# EAGLE design Keyglove Kit v0.2 (EAGLE 6.1)
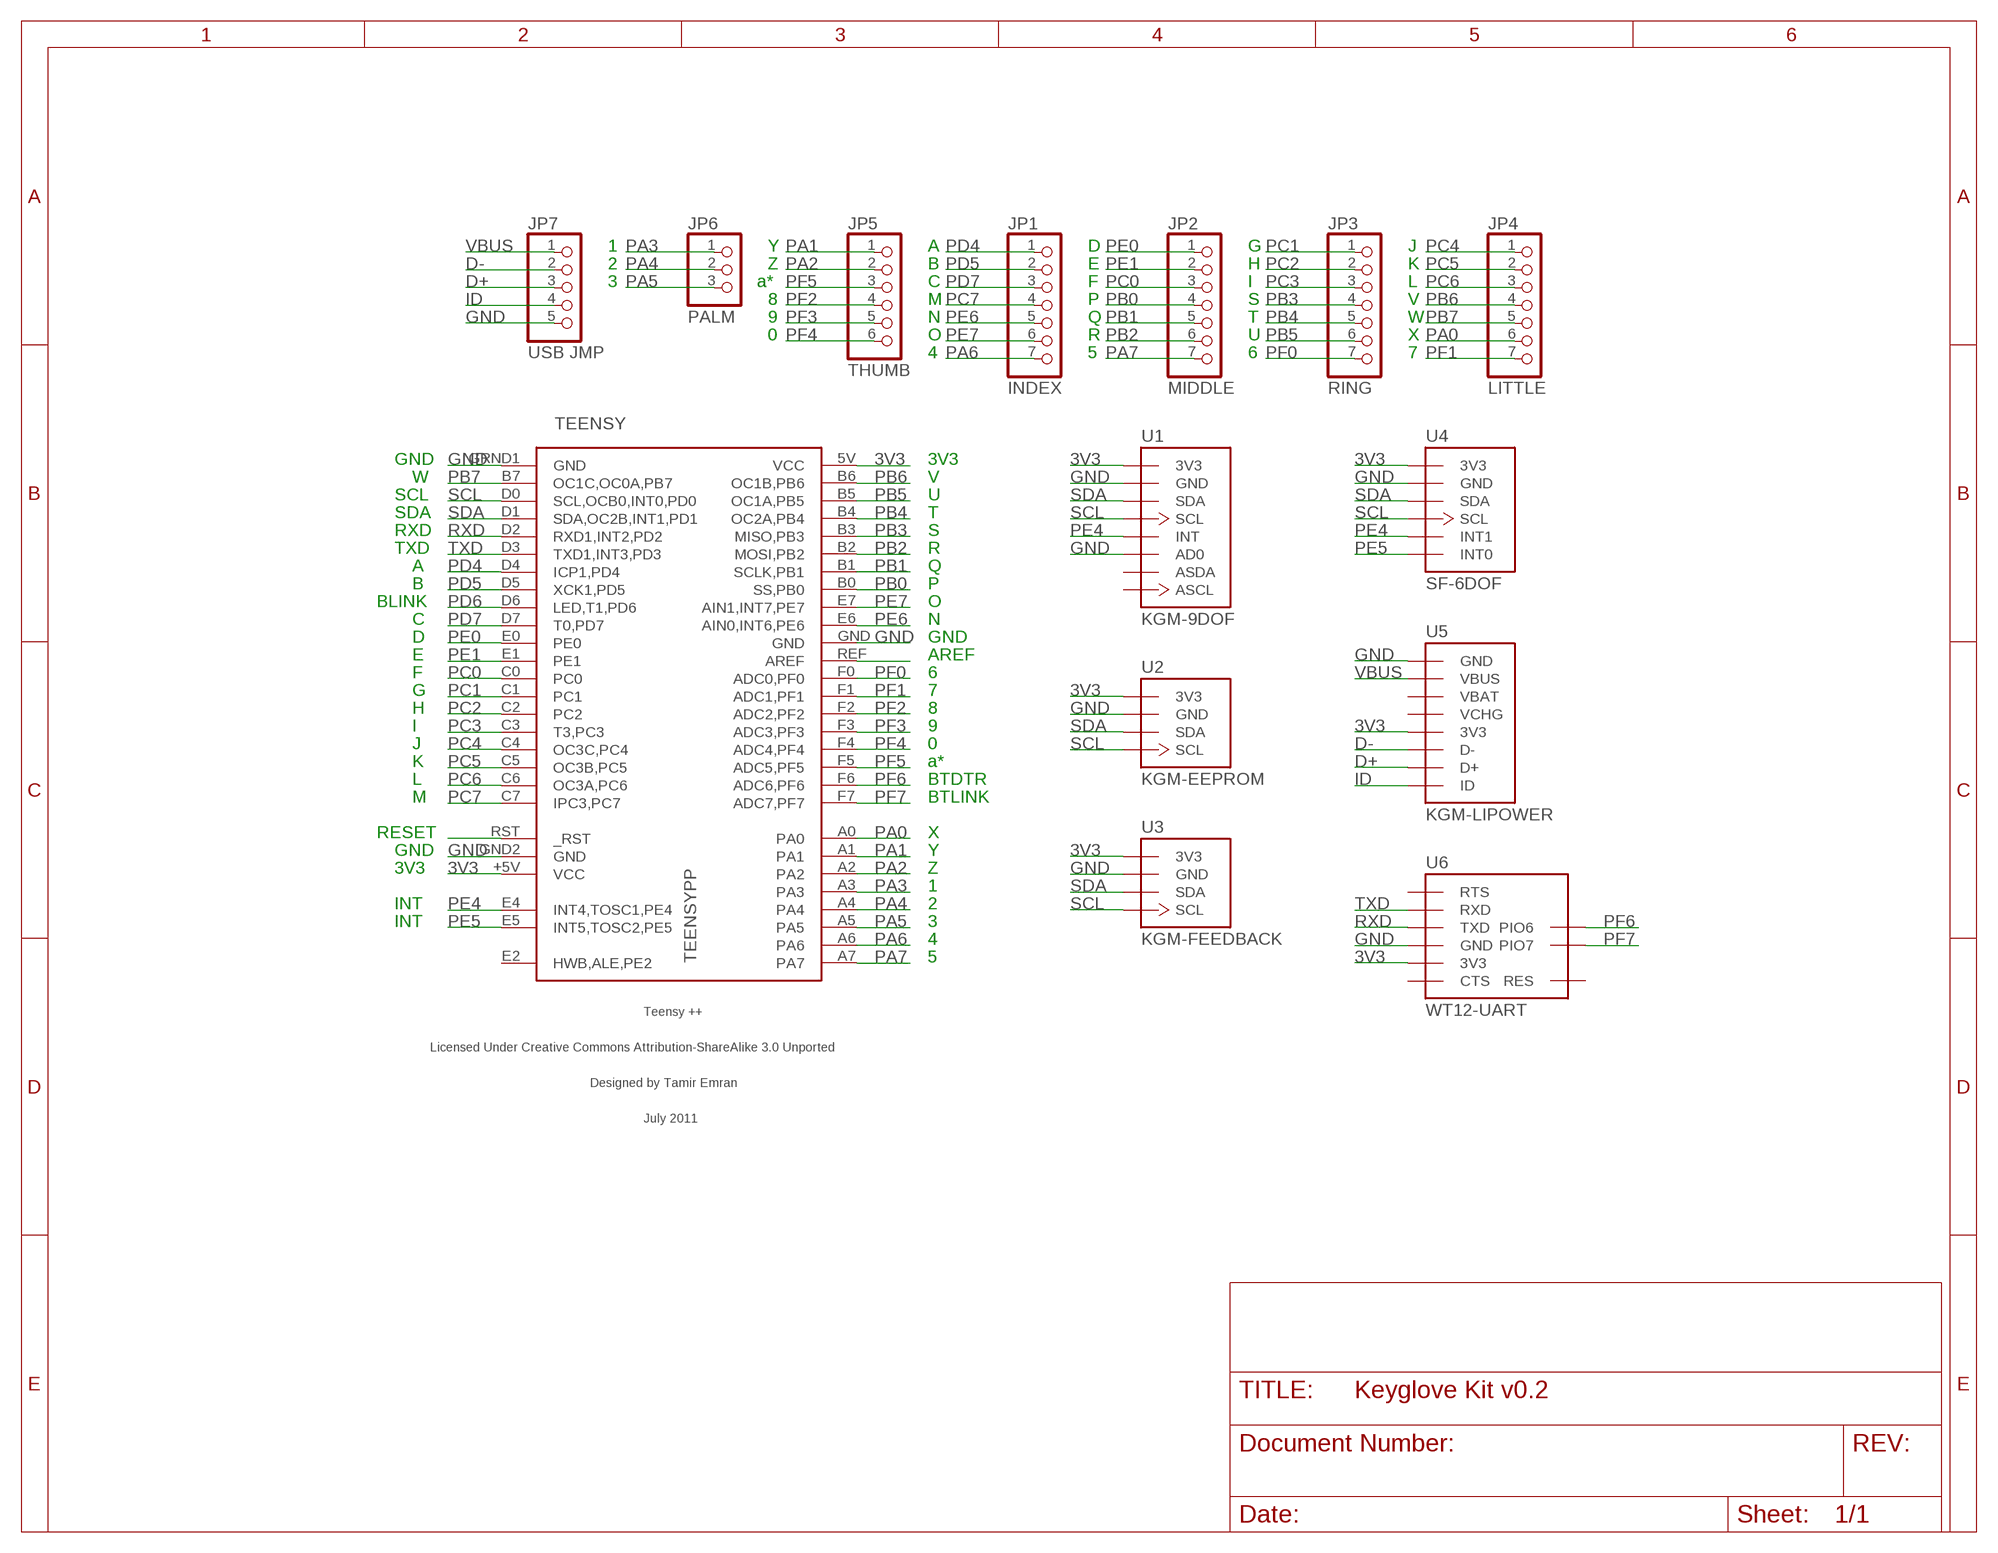
[diagram p0: schematic, sheet 1]

## Parts
JP1  INDEX  PINHD-1X7  [1X07]
JP2  MIDDLE  PINHD-1X7  [1X07]
JP3  RING  PINHD-1X7  [1X07]
JP4  LITTLE  PINHD-1X7  [1X07]
JP5  THUMB  PINHD-1X6  [1X06]
JP6  PALM  PINHD-1X3  [1X03]
JP7  USB JMP  PINHD-1X5  [1X05]
TEENSY  TEENSYPP  [TEENSYPP]
U1  KGM-9DOF  [KGM-9DOF]
U2  KGM-EEPROM  [KGM-EEPROM]
U3  KGM-FEEDBACK  [KGM-FEEDBACK]
U4  SF-6DOF  [SF-6DOF]
U5  KGM-LIPOWER  [KGM-LIPOWER]
U6  WT12-UART  [WT12-UART]

## Nets
3V3 [power]: TEENSY.5V(VCC) TEENSY.+5V(VCC) U1.3V3 U2.3V3 U3.3V3 U4.3V3 U5.3V3 U6.3V3
D+: JP7.3 U5.D+
D-: JP7.2 U5.D-
GND [power]: JP7.5 TEENSY.GND TEENSY.GND2(GND) TEENSY.GRND1(GND) U1.AD0 U1.GND U2.GND U3.GND U4.GND U5.GND U6.GND
ID: JP7.4 U5.ID
N$107: TEENSY.RST(_RST)
N$128: TEENSY.REF(AREF)
PA0: JP4.6 TEENSY.A0
PA1: JP5.1 TEENSY.A1
PA2: JP5.2 TEENSY.A2
PA3: JP6.1 TEENSY.A3
PA4: JP6.2 TEENSY.A4
PA5: JP6.3 TEENSY.A5
PA6: JP1.7 TEENSY.A6
PA7: JP2.7 TEENSY.A7
PB0: JP2.4 TEENSY.B0(SS,PB0)
PB1: JP2.5 TEENSY.B1(SCLK,PB1)
PB2: JP2.6 TEENSY.B2(MOSI,PB2)
PB3: JP3.4 TEENSY.B3(MISO,PB3)
PB4: JP3.5 TEENSY.B4(OC2A,PB4)
PB5: JP3.6 TEENSY.B5(OC1A,PB5)
PB6: JP4.4 TEENSY.B6(OC1B,PB6)
PB7: JP4.5 TEENSY.B7(OC1C,OC0A,PB7)
PC0: JP2.3 TEENSY.C0
PC1: JP3.1 TEENSY.C1
PC2: JP3.2 TEENSY.C2
PC3: JP3.3 TEENSY.C3(T3,PC3)
PC4: JP4.1 TEENSY.C4(OC3C,PC4)
PC5: JP4.2 TEENSY.C5(OC3B,PC5)
PC6: JP4.3 TEENSY.C6(OC3A,PC6)
PC7: JP1.4 TEENSY.C7(IPC3,PC7)
PD4: JP1.1 TEENSY.D4(ICP1,PD4)
PD5: JP1.2 TEENSY.D5(XCK1,PD5)
PD6: TEENSY.D6(LED,T1,PD6)
PD7: JP1.3 TEENSY.D7(T0,PD7)
PE0: JP2.1 TEENSY.E0
PE1: JP2.2 TEENSY.E1
PE4: TEENSY.E4(INT4,TOSC1,PE4) U1.INT U4.INT1
PE5: TEENSY.E5(INT5,TOSC2,PE5) U4.INT0
PE6: JP1.5 TEENSY.E6(AIN0,INT6,PE6)
PE7: JP1.6 TEENSY.E7(AIN1,INT7,PE7)
PF0: JP3.7 TEENSY.F0(ADC0,PF0)
PF1: JP4.7 TEENSY.F1(ADC1,PF1)
PF2: JP5.4 TEENSY.F2(ADC2,PF2)
PF3: JP5.5 TEENSY.F3(ADC3,PF3)
PF4: JP5.6 TEENSY.F4(ADC4,PF4)
PF5: JP5.3 TEENSY.F5(ADC5,PF5)
PF6: TEENSY.F6(ADC6,PF6) U6.PIO6
PF7: TEENSY.F7(ADC7,PF7) U6.PIO7
RXD: TEENSY.D2(RXD1,INT2,PD2) U6.TXD
SCL: TEENSY.D0(SCL,OCB0,INT0,PD0) U1.SCL U2.SCL U3.SCL U4.SCL
SDA: TEENSY.D1(SDA,OC2B,INT1,PD1) U1.SDA U2.SDA U3.SDA U4.SDA
TXD: TEENSY.D3(TXD1,INT3,PD3) U6.RXD
VBUS [power]: JP7.1 U5.VBUS
Unconnected: TEENSY.E2(HWB,ALE,PE2) U1.ASCL U1.ASDA U6.CTS U6.RESET(RES) U6.RTS

## Notes on the sheet
- 1 | Y | A | D | G | J
- 2 | Z | B | E | H | K
- 3 | a* | C | F | I | L
- 8 | M | P | S | V
- 9 | N | Q | T | W
- 0 | O | R | U | X
- 4 | 5 | 6 | 7
- GND | 3V3
- W | V
- SCL | U
- SDA | T
- RXD | S
- TXD | R
- A | Q
- B | P
- BLINK | O
- C | N
- D | GND
- E | AREF
- F | 6
- G | 7
- H | 8
- I | 9
- J | 0
- K | a*
- L | BTDTR
- M | BTLINK
- RESET | X
- GND | Y
- 3V3 | Z
- 1
- INT | 2
- INT | 3
- 4
- 5

## Power pins joined to a net without a drawn wire
VBAT: U5.VBAT
VCHG: U5.VCHG

## Library data of the parts
JP1-JP4 = sf-pinhead:PINHD-1X7: PIN HEADER
JP5 = sf-pinhead:PINHD-1X6: PIN HEADER
JP6 = sf-pinhead:PINHD-1X3: PIN HEADER
JP7 = sf-pinhead:PINHD-1X5: PIN HEADER
TEENSY = sf-keyglovekit:TEENSYPP: Teensy++ Teensy++ board by PJRC <http://www.pjrc.com/>. Eagle part designed by Tamir Emran, July 2011. Licensed under Create Commons Attribution-ShareAlike 3.0 Unported license (CC-BY-SA-3.0).
U1 = sf-keyglovekit:KGM-9DOF
U2 = sf-keyglovekit:KGM-EEPROM
U3 = sf-keyglovekit:KGM-FEEDBACK
U4 = sf-keyglovekit:SF-6DOF
U5 = sf-keyglovekit:KGM-LIPOWER
U6 = sf-keyglovekit:WT12-UART

## Net classes
0 default: width 0.152 mm, drill 0.33 mm, clearance 0.152 mm
1 power: width 0.203 mm, drill 0.33 mm, clearance 0.152 mm

## Board
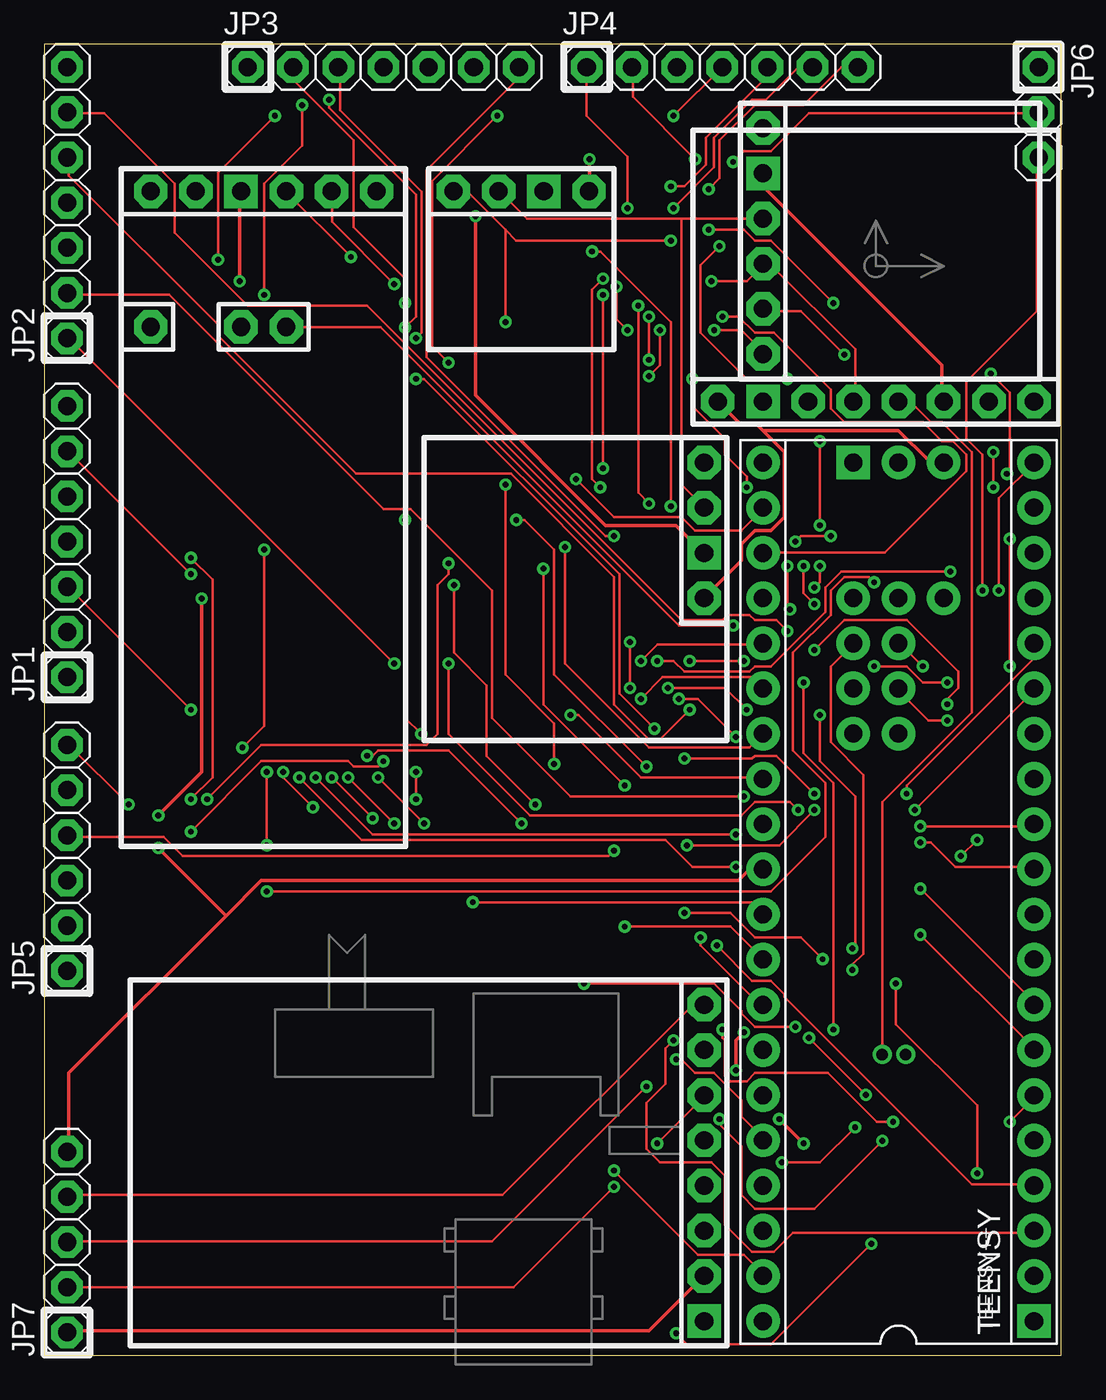
[diagram p1: board, top side]
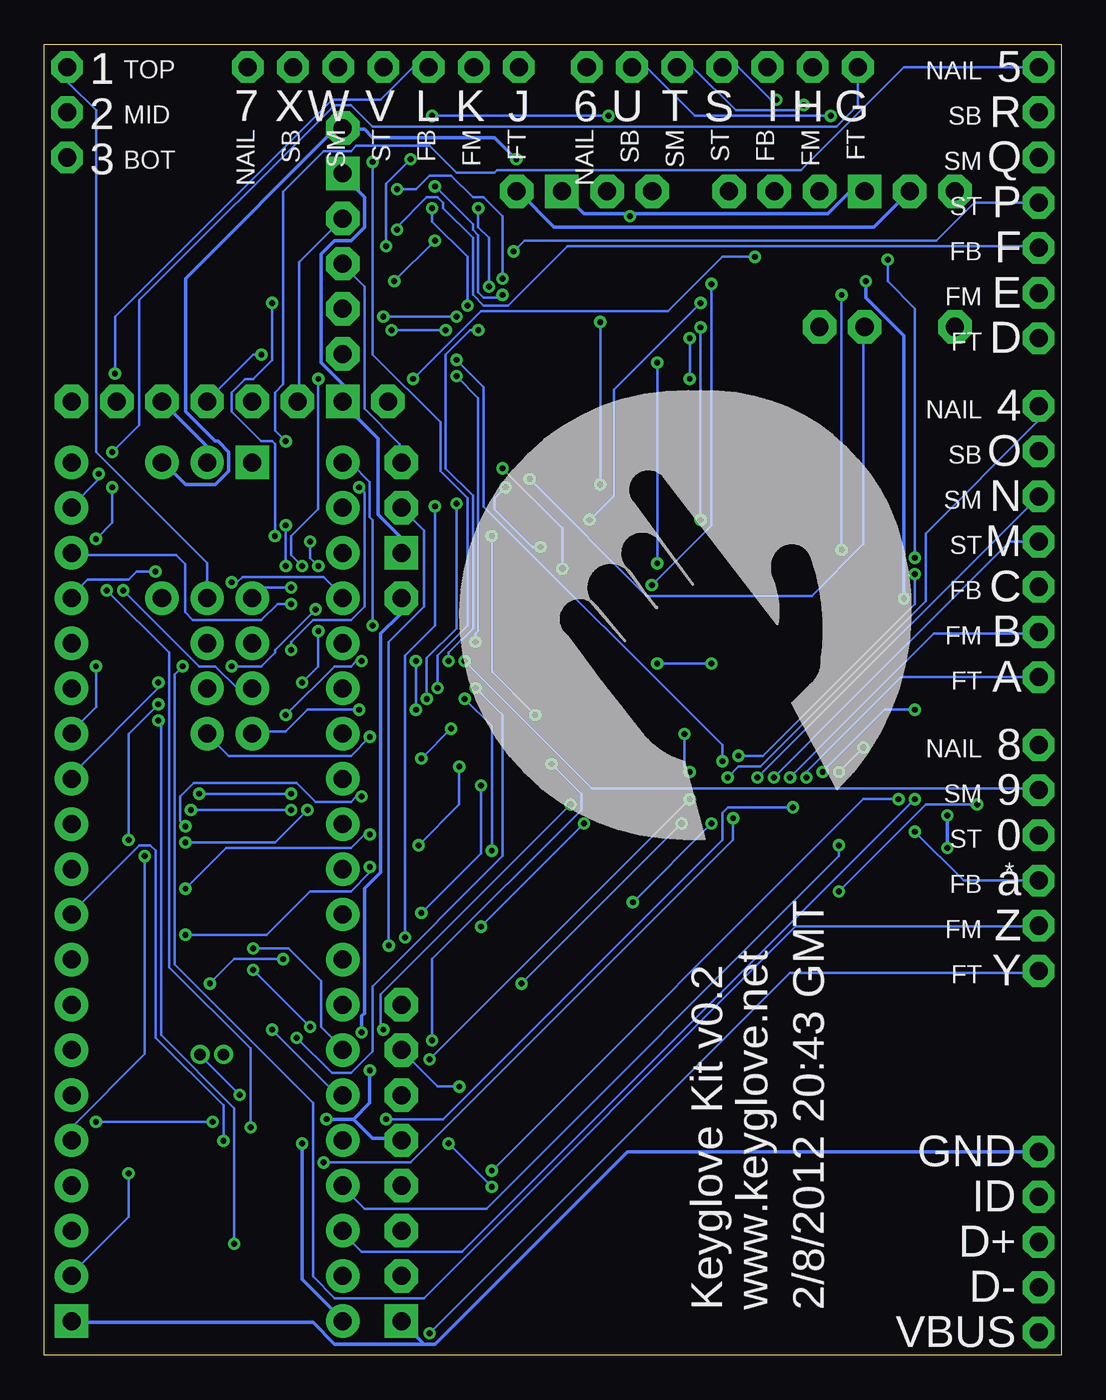
[diagram p2: board, bottom side, seen from below]

Size 57.15 x 73.66 mm. Coordinates in mm from the lower left corner, seen from the top.
Outline: 0,0 57.15,0 57.15,73.66 0,73.66 0,0
Copper layers (1*16): Top 0.0356mm / dielectric 1.5011mm / Bottom 0.0356mm
Design rules: minimum track width 6mil, minimum drill 13mil, track to track 6mil, track to pad 6mil, pad to pad 6mil, via to via 6mil, smd to smd 6mil, copper to edge 15mil, drill to drill 6mil, minimum pad ring 7mil, minimum via ring 7mil, stop-mask expansion 4mil, vias tented up to drill 20mil, thermal gap 10mil

### Footprints (pad centres in the part's own frame; a part is rotated, then mirrored left to right if it is on the bottom)
1X07 = drill 1.016 pad 1.778 octagon: 1 -7.62,0; 2 -5.08,0; 3 -2.54,0; 4 0,0; 5 2.54,0; 6 5.08,0; 7 7.62,0
1X06 = drill 1.016 pad 1.778 octagon: 1 -6.35,0; 2 -3.81,0; 3 -1.27,0; 4 1.27,0; 5 3.81,0; 6 6.35,0
1X03 = drill 1.016 pad 1.778 octagon: 1 -2.54,0; 2 0,0; 3 2.54,0
1X05 = drill 1.016 pad 1.778 octagon: 1 -5.08,0; 2 -2.54,0; 3 0,0; 4 2.54,0; 5 5.08,0
TEENSYPP = drill 1.016 pad 1.88: 5V 24.13,-2.54; +5V -24.13,7.62; A0 8.89,0; A1 11.43,0; A2 13.97,0; A3 16.51,0; A4 8.89,2.54; A5 11.43,2.54; A6 13.97,2.54; A7 16.51,2.54; B0 -6.35,7.62; B1 -8.89,7.62; B2 -11.43,7.62; B3 -13.97,7.62; B4 -16.51,7.62; B5 -19.05,7.62; B6 -21.59,7.62; B7 -21.59,-7.62; C0 6.35,-7.62; C1 8.89,-7.62; C2 11.43,-7.62; C3 13.97,-7.62; C4 16.51,-7.62; C5 19.05,-7.62; C6 21.59,-7.62; C7 24.13,-7.62; D0 -19.05,-7.62; D1 -16.51,-7.62; D2 -13.97,-7.62; D3 -11.43,-7.62; D4 -8.89,-7.62; D5 -6.35,-7.62; D6 -3.81,-7.62; D7 -1.27,-7.62; E0 1.27,-7.62; E1 3.81,-7.62; E2 16.51,-2.54; E6 -1.27,7.62; E7 -3.81,7.62; F0 6.35,7.62; F1 8.89,7.62; F2 11.43,7.62; F3 13.97,7.62; F4 16.51,7.62; F5 19.05,7.62; F6 21.59,7.62; F7 24.13,7.62; GND2 24.13,0; GRND1 1.27,7.62; REF 3.81,7.62 | drill 0.635 pad 1.067: E4 -9.144,0.914; E5 -9.144,-0.406 | drill 1.016 pad 1.88 square: GND -24.13,-7.62; RST 24.13,2.54
KGM-9DOF = drill 1.016 pad 1.88 octagon: 3V3 1.27,19.177; AD0 1.27,6.477; ASCL 1.27,1.397; ASDA 1.27,3.937; INT 1.27,9.017; SCL 1.27,11.557; SDA 1.27,14.097 | drill 1.016 pad 1.88 square: GND 1.27,16.637
KGM-EEPROM = drill 1.016 pad 1.88 octagon: 3V3 1.27,9.017; SCL 1.27,1.397; SDA 1.27,3.937 | drill 1.016 pad 1.88 square: GND 1.27,6.477
KGM-FEEDBACK = drill 1.016 pad 1.88 octagon: 3V3 1.27,9.017; SCL 1.27,1.397; SDA 1.27,3.937 | drill 1.016 pad 1.88 square: GND 1.27,6.477
SF-6DOF = drill 1.016 pad 1.88 octagon: 3V3 1.27,14.097; INT0 1.27,1.397; INT1 1.27,3.937; SCL 1.27,6.477; SDA 1.27,9.017 | drill 1.016 pad 1.88 square: GND 1.27,11.557
KGM-LIPOWER = drill 1.016 pad 1.88 octagon: 3V3 1.27,9.017; D+ 1.27,3.937; D- 1.27,6.477; ID 1.27,1.397; VBAT 1.27,14.097; VBUS 1.27,16.637; VCHG 1.27,11.557 | drill 1.016 pad 1.88 square: GND 1.27,19.177
WT12-UART = drill 1.016 pad 1.88 octagon: 3V3 1.27,4.191; CTS 1.27,1.651; PIO6 8.89,6.731; PIO7 8.89,9.271; RESET 8.89,1.651; RTS 1.27,14.351; RXD 1.27,11.811; TXD 1.27,9.271 | drill 1.016 pad 1.88 square: GND 1.27,6.731

### Placement (x,y rotation side)
JP1  1.27,45.72 90 top
JP2  1.27,64.77 90 top
JP3  19.05,72.39 0 top
JP4  38.1,72.39 0 top
JP5  1.27,27.94 90 top
JP6  55.88,69.85 270 top
JP7  1.27,6.35 90 top
TEENSY  48.01,26.04 90 top
U1  57.02,52.32 90 top
U2  21.59,66.67 270 top
U3  38.35,51.56 180 top
U4  39.12,54.86 0 top
U5  38.35,21.08 180 top
U6  4.32,66.67 270 top

### Tracks (layer width: path | path; a pad name or v marks a point on that pad's centre or on a via)
3V3  (via drill 0.33)
  Top 0.203: v30.63,67.21 30.63,65.53 U2.3V3 | v42.67,11.89 v41.3,13.26 | 37.19,42.52 U3.3V3 37.19,42.67 39.17,44.65 39.17,45.57 39.93,46.33 40.84,46.33 41.6,47.09 41.6,50.75 40.39,51.97 | 40.39,51.97 40.08,52.27 39.17,52.27 U1.3V3 | 40.39,51.97 48.01,51.97 49.68,50.29 50.44,50.29 TEENSY.5V | v38.86,16 38.86,17.68 v39.32,18.14
  Bottom 0.203: U6.3V3 10.52,63.4 28.5,63.4 30.48,65.38 U2.3V3 | 40.39,68.89 39.17,68.89 38.71,68.43 31.85,68.43 v30.63,67.21 | 39.78,13.26 38.71,12.19 37.19,12.19 U5.3V3 | v41.3,13.26 39.78,13.26 | v42.67,11.89 42.67,4.27 40.39,1.98 TEENSY.+5V | 39.78,13.26 38.86,14.17 v38.86,16 | v39.32,18.14 39.32,19.05 39.17,19.2 39.17,26.21 38.25,27.13 38.25,40.54 37.19,41.6 37.19,42.52 U3.3V3 | 40.39,68.89 40.84,68.89 49.23,60.5 49.23,53.03 47.55,51.36 47.4,51.36 46.79,50.75 46.79,49.68 47.55,48.92 49.23,48.92 50.44,50.14 TEENSY.5V | 40.39,68.89 U4.3V3
D+  (via drill 0.33)
  Top 0.152: v33.83,15.09 25.15,6.4 1.37,6.4 JP7.3
  Bottom 0.152: v33.83,15.09 35.05,15.09 37.03,17.07 U5.D+
D-  (via drill 0.33)
  Top 0.152: JP7.2 26.36,3.81 v32,9.45 | v34.44,11.89 37.03,14.48 U5.D-
  Bottom 0.152: v34.44,11.89 v32,9.45
GND  (via drill 0.33)
  Top 0.203: 37.19,45.11 U3.GND 37.03,45.11 35.51,46.63 31.55,46.63 24.23,53.95 v24.23,64.01 | 48.01,50.14 TEENSY.GND2 | U4.GND 40.39,65.68 50.44,55.63 50.44,53.65 U1.AD0 | 55.63,1.98 TEENSY.GND | 10.21,24.69 1.37,15.85 1.37,11.43 JP7.5 | 10.21,24.69 12.19,26.67 39.01,26.67 39.62,27.28 40.39,27.28 TEENSY.GRND1 | v10.97,60.35 10.97,65.38 U6.GND | v8.84,42.52 8.84,32.77 v6.4,30.33 | 10.21,24.69 v6.4,28.5
  Bottom 0.203: 24.23,64.16 26.82,64.16 U2.GND | 24.23,64.16 13.11,64.16 11.89,65.38 11.12,65.38 U6.GND | U3.GND 37.19,45.11 37.19,46.02 38.41,47.24 38.41,51.51 40.39,53.49 U1.GND 40.39,54.56 41.6,55.78 41.6,61.87 40.84,62.64 39.93,62.64 39.17,63.4 39.17,65.08 40.39,66.29 U4.GND | TEENSY.GND2 48.01,51.05 U1.AD0 | v24.23,64.01 24.23,64.16 | JP7.5 24.38,11.43 35.2,0.61 35.81,0.61 | 35.81,0.61 37.03,1.83 U5.GND | 35.81,0.61 40.84,0.61 42.06,1.83 55.63,1.83 TEENSY.GND | v10.97,60.35 10.97,59.44 8.84,57.3 v8.84,42.52 | v6.4,28.5 v6.4,30.33
ID
  Top 0.152: JP7.4 1.37,8.99 25.76,8.99 36.42,19.66 37.03,19.66 U5.ID
PA0  (via drill 0.33)
  Top 0.152: JP4.6 42.37,72.39 40.54,70.56 39.78,70.56 37.64,68.43 37.64,66.75 v35.36,64.47 | v33.38,58.98 33.38,48.46 v33.98,47.85 | v35.66,36.88 36.73,36.88 v38.86,34.75
  Bottom 0.152: v35.36,64.47 35.36,63.7 33.38,61.72 v33.38,58.98 | v33.98,47.85 33.98,40.84 35.66,39.17 v35.66,36.88 | v38.86,34.75 39.93,33.68 46.79,33.68 48.01,34.9 TEENSY.A0
PA1  (via drill 0.33)
  Top 0.152: v35.51,1.22 36.12,0.61 40.84,0.61 v46.48,6.25 | v50.75,35.66 49.68,35.66 48.01,37.34 TEENSY.A1
  Bottom 0.152: v35.51,1.22 15.24,21.49 1.37,21.49 JP5.1 | v46.48,6.25 46.48,13.87 50.6,17.98 50.6,35.51 v50.75,35.66
PA2  (via drill 0.33)
  Top 0.152: v49.38,38.71 48.01,40.08 TEENSY.A2
  Bottom 0.152: v49.38,38.71 49.84,38.25 49.84,21.95 42.06,14.17 42.06,4.42 40.84,3.2 35.81,3.2 14.94,24.08 1.37,24.08 JP5.2
PA3
  Bottom 0.152: TEENSY.A3 48.01,44.5 54.25,50.75 54.25,69.95 55.78,71.48 55.78,72.39 JP6.1
PA4  (via drill 0.33)
  Top 0.152: v38.71,67.06 39.32,67.67 40.84,67.67 42.98,69.8 55.78,69.8 JP6.2 | v35.05,37.49 38.25,37.49 v39.47,36.27
  Bottom 0.152: v38.71,67.06 38.71,56.24 34.9,52.43 34.9,49.68 33.38,48.16 33.38,41 35.05,39.32 v35.05,37.49 | v39.47,36.27 42.37,36.27 43.59,35.05 45.41,35.05 TEENSY.A4
PA5  (via drill 0.33)
  Top 0.152: v52.73,42.98 52.73,50.6 51.82,51.51 51.82,54.71 55.78,58.67 55.78,67.21 JP6.3
  Bottom 0.152: v52.73,42.98 48.46,38.71 47.55,38.71 46.33,37.49 45.57,37.49 TEENSY.A5
PA6  (via drill 0.33)
  Top 0.152: v21.34,29.87 v18.75,32.46 | v30.33,20.88 37.64,20.88 39.17,19.36 39.17,19.2 39.93,18.44 v42.22,18.44 | v45.41,21.64 45.41,21.95 46.02,22.55 46.02,32.61 44.2,34.44 44.2,38.71 45.41,39.93 TEENSY.A6
  Bottom 0.152: v18.75,32.46 18.14,33.07 16.92,33.07 7.62,42.37 7.62,46.18 1.37,52.43 1.37,53.34 JP1.7 | v30.33,20.88 v21.34,29.87 | v45.41,21.64 v42.22,18.44
PA7  (via drill 0.33)
  Top 0.152: v43.59,46.63 v43.59,51.36 | v43.59,44.35 43.59,43.43 v43.28,43.13
  Bottom 0.152: JP2.7 8.84,72.39 14.63,66.6 31.7,66.6 31.85,66.45 33.98,66.45 35.51,67.97 39.62,67.97 39.93,67.67 41.45,67.67 43.74,65.38 43.74,54.56 44.2,54.1 44.2,51.97 v43.59,51.36 | v43.59,44.35 v43.59,46.63 | v43.28,43.13 44.96,43.13 45.41,42.67 TEENSY.A7
PB0  (via drill 0.33)
  Top 0.152: v30.79,62.03 31.24,62.03 35.2,58.06 v35.2,47.7 | v36.88,23.47 36.88,23.01 40.08,19.81 40.39,19.81 TEENSY.B0
  Bottom 0.152: JP2.4 4.88,64.77 7.01,62.64 30.18,62.64 v30.79,62.03 | v35.2,47.7 35.2,41 36.88,39.32 v36.88,23.47
PB1  (via drill 0.33)
  Top 0.152: v36.27,36.27 34.59,34.59 33.98,34.59 32,36.58 32,43.74 26.21,49.53 17.53,49.53 9.75,57.3 9.75,57.91 1.37,66.29 1.37,67.21 JP2.5 | v39.32,39.01 v36.27,39.01 | v43.59,35.97 43.59,33.38 45.57,31.39 45.57,23.01 v45.41,22.86
  Bottom 0.152: v36.27,39.01 v36.27,36.27 | v39.32,39.01 39.62,39.01 39.93,38.71 40.84,38.71 v43.59,35.97 | v45.41,22.86 43.43,22.86 41.6,21.03 41.6,18.44 40.39,17.22 TEENSY.B1
PB2  (via drill 0.33)
  Top 0.152: v41.76,40.69 41.15,41.3 39.93,41.3 39.62,41.6 38.41,41.6 38.1,41.3 35.81,41.3 18.14,58.98 11.43,58.98 7.32,63.09 7.32,65.84 3.35,69.8 1.37,69.8 JP2.6 | v42.67,37.8 42.67,33.83 44.35,32.16 v44.35,18.29
  Bottom 0.152: v41.76,40.69 41.76,38.71 v42.67,37.8 | v44.35,18.29 40.69,14.63 40.39,14.63 TEENSY.B2
PB3  (via drill 0.33)
  Top 0.152: v16,70.56 16,70.1 20.88,65.23 20.88,58.37 v20.27,57.76 | v20.27,46.94 20.27,35.81 v21.18,34.9 | v20.88,31.24 v20.88,32.77 | v35.51,16.61 35.81,16.61 36.58,15.85 37.64,15.85 39.17,14.33 39.17,13.41 40.39,12.19 TEENSY.B3
  Bottom 0.152: JP3.4 18.14,72.39 16.31,70.56 v16,70.56 | v20.27,46.94 v20.27,57.76 | v21.18,34.9 21.18,33.07 v20.88,32.77 | v35.51,16.61 v20.88,31.24
PB4  (via drill 0.33)
  Top 0.152: v14.48,70.26 14.48,67.97 12.34,65.84 v12.34,59.59 | v12.34,45.26 12.34,35.36 v11.12,34.14 | v12.5,28.65 v12.5,32.77
  Bottom 0.152: JP3.5 20.73,72.39 18.29,69.95 14.78,69.95 v14.48,70.26 | v12.34,45.26 v12.34,59.59 | v12.5,32.77 v11.12,34.14 | v12.5,28.65 12.5,28.04 32.31,8.23 39.17,8.23 40.39,9.45 TEENSY.B4
PB5  (via drill 0.33)
  Top 0.152: v12.95,69.65 9.75,66.45 v9.75,61.57 | v8.23,44.81 9.45,43.59 9.45,32.46 v8.23,31.24
  Bottom 0.152: JP3.6 23.32,72.39 20.57,69.65 v12.95,69.65 | v9.75,61.57 9.75,60.35 8.23,58.83 v8.23,44.81 | v8.23,31.24 33.68,5.79 39.32,5.79 40.39,6.86 TEENSY.B5
PB6  (via drill 0.33)
  Top 0.152: v35.36,69.65 JP4.4 | v25.45,69.65 21.79,65.99 21.79,56.69 v22.71,55.78 | v22.71,44.5 22.71,43.89 22.1,43.28 22.1,34.9 21.49,34.29 12.19,34.29 v9.14,31.24 | v32,10.36 36.73,5.64 39.32,5.64 40.39,4.57 TEENSY.B6
  Bottom 0.152: v25.45,69.65 v35.36,69.65 | v22.71,44.5 v22.71,55.78 | v9.14,31.24 11.12,31.24 v32,10.36
PB7  (via drill 0.33)
  Top 0.152: v35.2,65.68 35.97,65.68 37.19,66.9 37.19,68.43 40.54,71.78 40.54,72.39 JP4.5 | v31.39,49.84 v31.39,59.59 | v28.04,44.2 28.04,36.58 v32.61,32 | v35.97,24.84 38.56,24.84 39.93,23.47 42.52,23.47 v43.74,22.25 | v47.85,20.88 47.85,18.59 52.43,14.02 v52.43,10.21
  Bottom 0.152: v35.2,65.68 33.07,63.55 33.07,63.25 32.77,62.94 32.77,59.74 32.46,59.44 31.55,59.44 v31.39,59.59 | v31.39,49.84 28.04,46.48 v28.04,44.2 | v32.61,32 32.61,28.19 v35.97,24.84 | v43.74,22.25 46.48,22.25 v47.85,20.88 | v52.43,10.21 52.43,7.77 55.63,4.57 TEENSY.B7
PC0  (via drill 0.33)
  Top 0.152: v37.34,63.25 39.32,63.25 39.93,62.64 40.84,62.64 v44.35,59.13 | v44.2,46.02 42.52,46.02 v42.22,45.72 | v41.76,44.35 41.76,42.06 v41.91,41.91 | v46.63,38.71 48.46,38.71 49.38,37.8 v50.75,37.8
  Bottom 0.152: v37.34,63.25 37.34,63.4 35.66,65.08 35.05,65.08 34.75,64.77 34.75,64.47 33.07,62.79 33.07,59.59 32.46,58.98 31.09,58.98 27.74,62.33 1.37,62.33 JP2.3 | v44.35,59.13 44.35,55.93 45.41,54.86 45.87,54.86 46.63,54.1 46.63,53.03 44.96,51.36 44.35,51.36 44.2,51.21 v44.2,46.02 | v42.22,45.72 42.22,44.81 v41.76,44.35 | v41.91,41.91 44.2,39.62 44.2,39.47 44.96,38.71 v46.63,38.71 | v50.75,37.8 50.75,37.49 55.63,32.61 TEENSY.C0
PC1  (via drill 0.33)
  Top 0.152: v53.34,48.77 v53.34,50.75 | v54.25,38.71 v54.25,45.87
  Bottom 0.152: JP3.1 11.43,70.26 12.65,69.04 38.71,69.04 39.93,70.26 40.84,70.26 51.82,59.28 51.82,52.27 v53.34,50.75 | v53.34,48.77 53.34,46.79 v54.25,45.87 | v54.25,38.71 54.25,36.42 55.63,35.05 TEENSY.C1
PC2  (via drill 0.33)
  Top 0.152: v20.27,59.13 20.27,60.5 17.37,63.4 17.37,68.28 14.02,71.63 14.02,72.39 JP3.2 | v26.52,46.94 26.98,46.94 28.65,45.26 28.65,38.25 v33.83,33.07 | v36.12,28.65 41.3,28.65 v43.28,30.63 | v48.92,30.63 55.63,37.34 TEENSY.C2
  Bottom 0.152: v20.27,59.13 25.15,54.25 25.15,48.31 v26.52,46.94 | v33.83,33.07 33.83,30.94 v36.12,28.65 | v48.92,30.63 v43.28,30.63
PC3  (via drill 0.33)
  Top 0.152: v20.88,57.15 21.18,57.45 21.18,65.38 16.61,69.95 16.61,72.39 JP3.3 | v20.88,54.86 21.34,54.86 32.31,43.89 32.31,37.19 v34.29,35.2 | v35.97,33.53 39.78,33.53 39.93,33.68 41.15,33.68 v43.28,31.55 | v48.46,31.55 48.46,32 55.63,39.17 TEENSY.C3
  Bottom 0.152: v20.88,54.86 v20.88,57.15 | v35.97,33.53 v34.29,35.2 | v48.46,31.55 v43.28,31.55
PC4  (via drill 0.33)
  Top 0.152: JP4.1 30.48,69.65 32.77,67.36 v32.77,64.47 | v32.16,60.05 32.16,58.22 v32.77,57.61 | v34.44,39.01 35.36,39.01 35.97,38.41 39.62,38.41 39.93,38.71 40.84,38.71 43.89,41.76 43.89,43.13 44.81,44.04 50.9,44.04 v50.91,44.03
  Bottom 0.152: v32.77,64.47 32.77,63.4 32.16,62.79 v32.16,60.05 | v32.77,57.61 33.22,57.61 34.59,56.24 34.59,49.84 33.07,48.31 33.07,40.84 34.44,39.47 v34.44,39.01 | v50.91,44.03 51.97,44.03 52.43,43.59 54.71,43.59 55.63,42.67 TEENSY.C4
PC5  (via drill 0.33)
  Top 0.152: v36.58,67.21 33.07,70.71 33.07,72.39 JP4.2 | v37.95,62.33 36.88,61.27 36.88,57.45 39.47,54.86 v41.76,54.86 | v42.67,44.35 42.67,42.82 v43.28,42.22
  Bottom 0.152: v36.58,67.21 37.95,65.84 v37.95,62.33 | v41.76,54.86 41.76,47.55 43.28,46.02 43.28,44.96 v42.67,44.35 | v43.28,42.22 44.04,42.22 44.96,41.3 48.81,41.3 49.25,41.75 49.25,44.45 49.76,44.96 55.63,44.96 TEENSY.C5
PC6  (via drill 0.33)
  Top 0.152: v53.19,55.17 54.25,54.1 54.25,49.68 v54.1,49.53
  Bottom 0.152: JP4.3 36.42,72.39 38.25,70.56 41,70.56 53.19,58.37 v53.19,55.17 | v54.1,49.53 54.1,49.23 55.63,47.7 TEENSY.C6
PC7  (via drill 0.33)
  Top 0.152: v18.44,30.18 v16.15,32.46 | v41.45,10.82 43.59,10.82 v45.57,12.8 | v53.65,42.98 53.65,48.16 55.63,50.14 TEENSY.C7
  Bottom 0.152: JP1.4 2.9,45.72 v16.15,32.46 | v18.44,30.18 18.44,28.96 36.58,10.82 v41.45,10.82 | v45.57,12.8 45.57,17.22 50.14,21.79 50.14,39.47 v53.65,42.98
PD4  (via drill 0.33)
  Top 0.152: v14.33,32.46 17.83,28.96 34.9,28.96 36.42,27.43 v38.86,27.43 | v49.23,23.62 55.63,17.22 TEENSY.D4
  Bottom 0.152: JP1.1 8.99,38.1 14.33,32.77 v14.33,32.46 | v38.86,27.43 38.86,27.13 39.93,26.06 42.22,26.06 44.65,23.62 v49.23,23.62
PD5  (via drill 0.33)
  Top 0.152: v15.24,32.46 18.44,29.26 v38.86,29.26 | v49.23,26.21 55.63,19.81 TEENSY.D5
  Bottom 0.152: v15.24,32.46 7.16,40.54 1.37,40.54 JP1.2 | v38.86,29.26 39.17,29.26 39.93,28.5 46.94,28.5 v49.23,26.21
PD7  (via drill 0.33)
  Top 0.152: v8.23,36.27 1.37,43.13 JP1.3 | v13.41,32.77 13.41,32.46 v15.09,30.79 | v37.95,13.26 37.95,12.95 39.17,11.73 39.17,8.99 39.93,8.23 43.28,8.23 v47.09,12.04
  Bottom 0.152: v8.23,36.27 9.91,36.27 v13.41,32.77 | v15.09,30.79 18.75,30.79 19.05,30.48 19.05,28.96 34.75,13.26 v37.95,13.26 | v47.09,12.04 47.09,14.02 50.9,17.83 50.9,28.35 51.21,28.65 51.82,28.65 55.63,24.84 TEENSY.D7
PE0  (via drill 0.33)
  Top 0.152: v19.66,38.86 1.37,57.15 JP2.1 | v22.71,38.86 22.71,34.9 27.28,30.33 39.17,30.33 39.93,31.09 41.91,31.09 v42.37,30.63 | v49.23,28.8 49.84,28.8 51.21,27.43 55.63,27.43 TEENSY.E0
  Bottom 0.152: v22.71,38.86 v19.66,38.86 | v42.37,30.63 44.2,28.8 v49.23,28.8
PE1  (via drill 0.33)
  Top 0.152: v39.32,31.39 29.57,31.39 25.15,35.81 25.15,42.98 20.57,47.55 19.05,47.55 7.01,59.59 1.37,59.59 JP2.2 | v49.23,29.72 55.63,29.72 TEENSY.E1
  Bottom 0.152: v39.32,31.39 39.62,31.39 39.93,31.09 41.91,31.09 42.98,32.16 48.77,32.16 49.53,31.39 49.53,30.02 v49.23,29.72
PE4  (via drill 0.33)
  Top 0.152: TEENSY.E4 47.09,31.09 52.12,36.12 52.12,50.75 50.44,52.43 49.84,52.43 48.77,53.49 48.01,53.49 U1.INT | v44.96,56.24 42.52,58.67 40.39,58.67 U4.INT1
  Bottom 0.152: v44.96,56.24 45.41,56.24 48.01,53.65 U1.INT
PE5  (via drill 0.33)
  Top 0.152: v42.98,17.83 v46.18,14.63 | v32.92,40.08 v32.92,37.49 | v33.98,55.02 34.59,55.63 v34.59,57.61 | v37.64,57.61 39.17,57.61 40.39,56.39 U4.INT0
  Bottom 0.152: v46.18,14.63 48.31,16.76 TEENSY.E5 | v42.98,17.83 41,15.85 39.93,15.85 38.71,17.07 38.71,20.73 31.39,28.04 31.39,35.97 v32.92,37.49 | v32.92,40.08 32.92,40.54 32.77,40.69 32.77,53.8 v33.98,55.02 | v37.64,57.61 v34.59,57.61
PE6  (via drill 0.33)
  Top 0.152: v19.66,29.87 v17.07,32.46 | v24.08,25.45 39.78,25.45 40.39,24.84 TEENSY.E6
  Bottom 0.152: v17.07,32.46 JP1.5 | v24.08,25.45 v19.66,29.87
PE7  (via drill 0.33)
  Top 0.152: v8.23,43.89 1.37,50.75 JP1.6 | v18.14,33.68 18.44,33.68 18.75,33.98 22.71,33.98 v26.82,29.87 | v32.61,24.08 38.56,24.08 40.39,22.25 TEENSY.E7
  Bottom 0.152: v8.23,43.89 8.23,42.22 16.76,33.68 v18.14,33.68 | v32.61,24.08 v26.82,29.87
PF0  (via drill 0.33)
  Top 0.152: JP3.7 26.67,71.78 21.49,66.6 21.49,56.08 31.55,46.02 v32,46.02 | v29.57,35.97 30.02,35.97 33.53,32.46 40.39,32.46 TEENSY.F0
  Bottom 0.152: v32,46.02 32,38.41 v29.57,35.97
PF1  (via drill 0.33)
  Top 0.152: JP4.7 44.81,72.39 42.67,70.26 39.93,70.26 37.95,68.28 37.95,66.14 v37.34,65.53 | v31.39,60.5 30.79,59.89 30.79,49.23 v31.24,48.77 | v29.26,45.41 29.26,38.86 33.98,34.14 39.62,34.14 40.39,34.9 TEENSY.F1
  Bottom 0.152: v37.34,65.53 36.27,65.53 35.51,66.29 34.29,66.29 33.07,65.08 32.46,65.08 31.39,64.01 v31.39,60.5 | v31.24,48.77 31.85,48.16 31.85,47.55 29.72,45.41 v29.26,45.41
PF2  (via drill 0.33)
  Top 0.152: v32,28.35 31.7,28.04 7.77,28.04 6.71,29.11 1.37,29.11 JP5.4 | v33.53,36.88 34.75,38.1 39.78,38.1 40.39,37.49 TEENSY.F2
  Bottom 0.152: v32,28.35 32,35.36 v33.53,36.88
PF3  (via drill 0.33)
  Top 0.152: v33.53,39.01 34.44,39.93 40.39,39.93 TEENSY.F3
  Bottom 0.152: v33.53,39.01 26.36,31.85 1.37,31.85 JP5.5
PF4  (via drill 0.33)
  Top 0.152: v4.72,30.94 1.37,34.29 JP5.6 | v12.5,26.06 40.84,26.06 43.89,29.11 43.89,32.16 42.06,33.98 42.06,39.47 44.2,41.6 44.2,42.98 44.96,43.74 46.33,43.74 v46.63,43.43
  Bottom 0.152: v4.72,30.94 7.62,30.94 v12.5,26.06 | v46.63,43.43 46.33,43.43 46.02,43.74 41.45,43.74 40.39,42.67 TEENSY.F4
PF5  (via drill 0.33)
  Top 0.152: v8.23,29.41 12.19,33.38 17.07,33.38 17.37,33.07 18.75,33.07 v19.05,33.38 | v33.98,58.37 v33.98,55.93 | v38.1,58.37 39.01,58.37 39.93,57.45 41,57.45 44.2,54.25 44.2,53.19 44.96,52.43 49.38,52.43 50.44,51.36 51.05,51.36 51.82,50.6 51.82,49.68 47.24,45.11 40.39,45.11 TEENSY.F5
  Bottom 0.152: JP5.3 5.49,26.67 v8.23,29.41 | v19.05,33.38 19.05,34.29 32.46,47.7 32.46,54.41 v33.98,55.93 | v38.1,58.37 v33.98,58.37
PF6  (via drill 0.33)
  Top 0.152: v29.87,49.23 32,47.09 35.81,47.09 36.58,46.33 39.17,46.33 40.39,47.55 TEENSY.F6
  Bottom 0.152: v29.87,49.23 23.32,42.67 14.02,42.67 11.12,45.57 11.12,57.76 U6.PIO6
PF7  (via drill 0.33)
  Top 0.152: v38.71,41 35.66,41 18.9,57.76 13.72,57.76 U6.PIO7
  Bottom 0.152: v38.71,41 38.71,46.94 38.86,47.09 38.86,49.07 39.93,50.14 40.39,50.14 TEENSY.F7
RXD  (via drill 0.33)
  Top 0.152: v52.43,28.96 v51.51,28.04 | v50.75,36.58 50.75,36.88 51.36,37.49 51.36,38.41 48.46,41.3 44.96,41.3 v43.28,39.62 | v39.47,48.77 39.47,49.38 38.25,50.6 38.25,51.51 36.42,53.34 v36.42,54.86 | v17.22,61.72 13.56,65.38 U6.TXD
  Bottom 0.152: TEENSY.D2 55.63,12.8 51.51,16.92 v51.51,28.04 | v52.43,28.96 52.43,34.9 v50.75,36.58 | v43.28,39.62 43.28,40.08 42.06,41.3 39.93,41.3 39.17,42.06 39.17,48.46 v39.47,48.77 | v36.42,54.86 32.61,58.67 22.1,58.67 19.05,61.72 v17.22,61.72
SCL  (via drill 0.33)
  Top 0.152: 25.91,63.25 26.52,62.64 v35.2,62.64 | 25.91,63.25 23.77,65.38 23.01,65.38 U2.SCL | v37.49,60.35 39.47,60.35 40.39,61.27 | v35.36,17.68 34.9,17.22 34.9,15.24 33.83,14.17 33.83,11.58 34.59,10.82 37.49,10.82 38.25,10.06 38.25,7.32 39.78,5.79 41,5.79 42.06,6.86 55.63,6.86 TEENSY.D0 | v28.65,33.22 28.65,35.51 25.91,38.25 v25.91,48.92 | 25.91,63.25 v25.91,58.06 | 40.39,61.27 40.84,61.27 45.57,56.54 45.57,53.65 U1.SCL | 40.39,61.27 U4.SCL
  Bottom 0.152: v37.49,60.35 v35.2,62.64 | v35.36,17.68 35.36,22.25 26.98,30.63 26.98,31.55 v28.65,33.22 | v25.91,58.06 v25.91,48.92 | U3.SCL 37.19,50.29 37.19,51.21 39.17,53.19 39.17,60.05 40.39,61.27 U4.SCL
SDA  (via drill 0.33)
  Top 0.152: 35.81,63.86 40.39,63.86 U4.SDA | 35.81,63.86 27.13,63.86 25.6,65.38 U2.SDA | v37.8,23.01 39.78,21.03 40.84,21.03 41.6,20.27 41.6,20.12 52.12,9.6 55.63,9.6 TEENSY.D1 | 35.81,63.86 35.81,48.92 37.03,47.7 U3.SDA
  Bottom 0.152: U1.SDA 42.82,53.65 42.82,61.42 40.39,63.86 U4.SDA | v37.8,23.01 37.8,40.08 35.81,42.06 35.81,46.33 37.03,47.55 U3.SDA
TXD  (via drill 0.33)
  Top 0.152: v19.66,60.2 16.15,63.7 16.15,65.38 U6.RXD | v23.01,43.28 23.01,39.47 24.84,37.64 24.84,33.68 v27.58,30.94 | v38.1,18.29 38.1,17.83 38.25,17.68 38.25,15.7 38.56,15.39 39.47,15.39 39.93,15.85 44.04,15.85 46.79,13.11 v47.7,13.11 | v54.25,13.11 55.63,14.48 TEENSY.D3
  Bottom 0.152: v19.66,60.2 19.66,46.63 v23.01,43.28 | v27.58,30.94 38.25,20.27 38.25,18.44 v38.1,18.29 | v54.25,13.11 v47.7,13.11
VBUS
  Top 0.203: JP7.1 1.37,1.37 33.98,1.37 37.03,4.42 U5.VBUS

### Text on the board
tPlace: TEENSY++
bPlace: 5 | NAIL | TOP | R | G | H | I | S | T | U | 6 | J | K | L | V | W | X | 7 | 1 | SB | FT | FM | FB | ST | SM | SB | NAIL | FT | FM | FB | ST | SM | SB | NAIL | MID | 2 | Q | SM | BOT | P | 3 | ST | F | FB | E | FM | D | FT | 4 | NAIL | O | SB | N | SM | M | ST | C | FB | B | FM | A | FT | 8 | NAIL | 9 | SM | 0 | ST | a | * | FB | Z | FM | Y | FT | GND | ID | D+ | D- | 2/8/2012 20:43 GMT | www.keyglove.net | Keyglove Kit v0.2 | VBUS